# EAGLE design ESP_LoRa_Thermal_V1.62 (EAGLE 9.6.2)
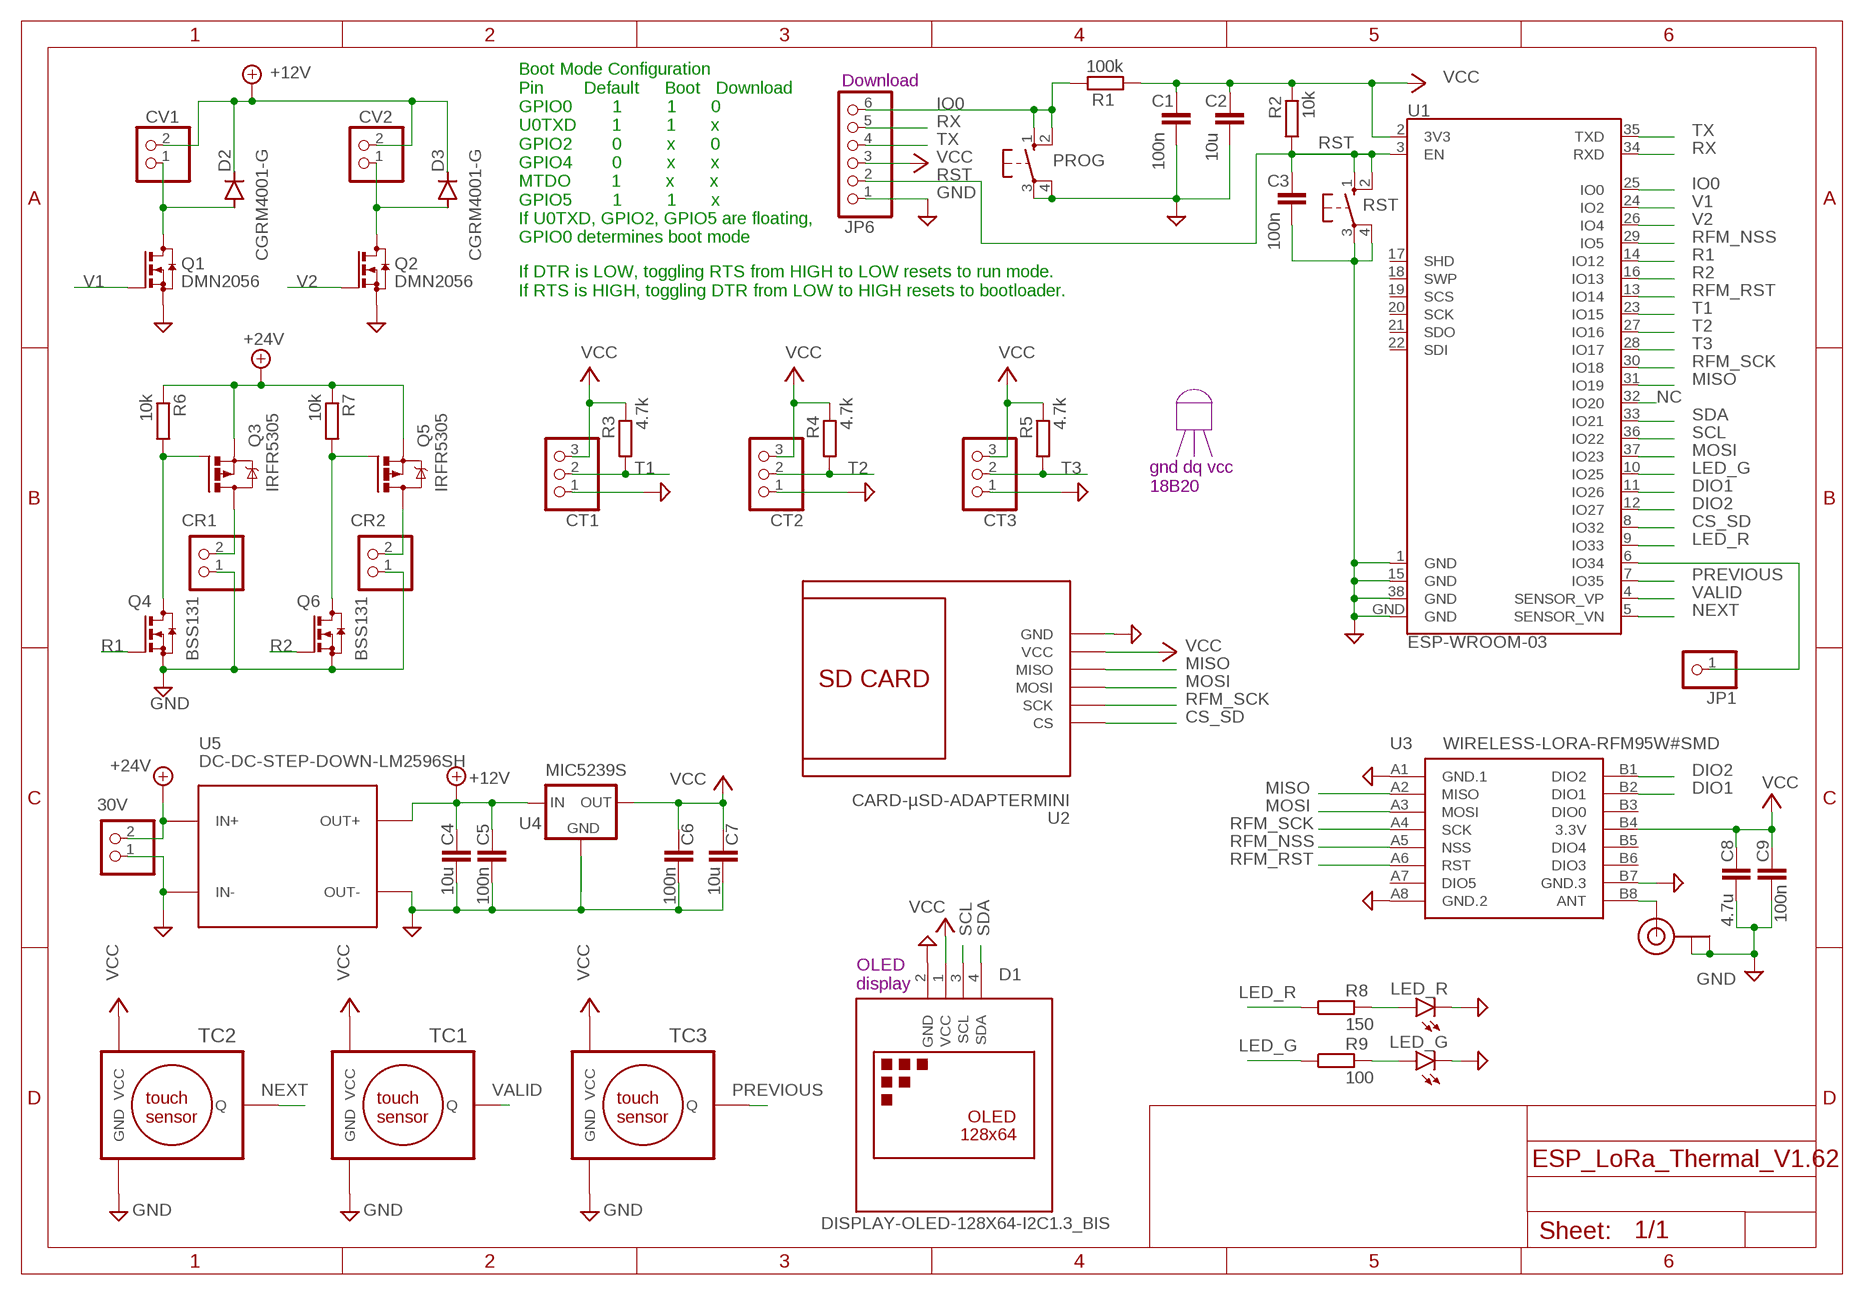
[diagram p0: schematic, sheet 1]

## Parts
30V  PINHD-1X2  [1X02]
C1  100n  CC1206  [C1206]
C2  10u  CC1206  [C1206]
C3  100n  CC1206  [C1206]
C4  10u  CC1206  [C1206]
C5  100n  CC1206  [C1206]
C6  100n  CC1206  [C1206]
C7  10u  CC1206  [C1206]
C8  4.7u  CC1206  [C1206]
C9  100n  CC1206  [C1206]
CR1  PINHD-1X2  [1X02]
CR2  PINHD-1X2  [1X02]
CT1  PINHD-1X3  [1X03]
CT2  PINHD-1X3  [1X03]
CT3  PINHD-1X3  [1X03]
CV1  PINHD-1X2  [1X02]
CV2  PINHD-1X2  [1X02]
D1  DISPLAY-OLED-128X64-I2C1.3_BIS  [DISPLAY-OLED-128X64-1.3-I2C_BIS]
D2  CGRM4001-G  [SOD-123_MINI-SMA]
D3  CGRM4001-G  [SOD-123_MINI-SMA]
J1  U.FL  [U.FL]
JP1  PINHD-1X1  [1X01]
JP6  PINHD-1X6  [1X06]
LED_G  LEDSMT1206  [1206]
LED_R  LEDSMT1206  [1206]
PROG  10-XX  [B3F-10XX]
Q1  DMN2056  [SOT23]
Q2  DMN2056  [SOT23]
Q3  IRFR5305  [D-PAK_TO252AA]
Q4  BSS131  [SOT23]
Q5  IRFR5305  [D-PAK_TO252AA]
Q6  BSS131  [SOT23]
R1  100k  RR1206  [R1206]
R2  10k  RR1206  [R1206]
R3  4.7k  RR1206  [R1206]
R4  4.7k  RR1206  [R1206]
R5  4.7k  RR1206  [R1206]
R6  10k  R-EU_R1206  [R1206]
R7  10k  R-EU_R1206  [R1206]
R8  150  RR1206  [R1206]
R9  100  RR1206  [R1206]
RST  10-XX  [B3F-10XX]
TC1  TTP223R_H  [TTP233RED_H]
TC2  TTP223R_H  [TTP233RED_H]
TC3  TTP223R_H  [TTP233RED_H]
U1  ESP-WROOM-03  [ESP-WROOM-03]
U2  CARD-µSD-ADAPTERMINI  [CARD-MINI--µSD-READER]
U3  WIRELESS-LORA-RFM95W#SMD  [WIRELESS-LORA-RFM95W#SMD]
U4  MIC5239S  [SOT223]
U5  DC-DC-STEP-DOWN-LM2596SH  [DC-DC-STEP-DOWN-LM2596-SH]

## Nets
+12V: C4.1 C5.1 CV1.2 CV2.2 D2.C D3.C U4.1(IN) U5.OUT+
+24V: 30V.2 Q3.3(S) Q5.3(S) R6.1 R7.1 U5.IN+
ANT: J1.3(SIGNAL) U3.B8(ANT)
CS_SD: U1.8(IO32) U2.CS
DIO1: U1.11(IO26) U3.B2(DIO1)
DIO2: U1.12(IO27) U3.B1(DIO2)
GND: 30V.1 C1.2 C2.2 C3.2 C4.2 C5.2 C6.2 C7.2 C8.2 C9.2 CR1.1 CR2.1 CT1.1 CT2.1 CT3.1 D1.2(GND) J1.1(GND) J1.2(GND) JP6.1 LED_G.C LED_R.C PROG.3(P) PROG.4(P1) Q1.2(S) Q2.2(S) Q4.2(S) Q6.2(S) RST.3(P) RST.4(P1) TC1.P$3(GND) TC2.P$3(GND) TC3.P$3(GND) U1.1(GND) U1.15(GND) U1.38(GND) U1.GND U2.GND U3.A1(GND.1) U3.A8(GND.2) U3.B7(GND.3) U4.2(GND) U4.4(GND) U5.IN- U5.OUT-
IO0: JP6.6 PROG.1(S) PROG.2(S1) R1.2 U1.25(IO0)
LED_G: R9.1 U1.10(IO25)
LED_R: R8.1 U1.9(IO33)
MISO: U1.31(IO19) U2.MISO U3.A2(MISO)
MOSI: U1.37(IO23) U2.MOSI U3.A3(MOSI)
N$1: CR2.2 Q5.4(D)
N$2: CV1.1 D2.A Q1.3(D)
N$4: CR1.2 Q3.4(D)
N$5: CV2.1 D3.A Q2.3(D)
N$6: JP1.1 U1.6(IO34)
N$7: LED_R.A R8.2
N$8: LED_G.A R9.2
N$23: Q3.1(G) Q4.3(D) R6.2
N$24: Q5.1(G) Q6.3(D) R7.2
NC: U1.32(IO20)
NEXT: TC2.P$2(Q) U1.5(SENSOR_VN)
PREVIOUS: TC3.P$2(Q) U1.7(IO35)
R1: Q4.1(G) U1.14(IO12)
R2: Q6.1(G) U1.16(IO13)
RFM_NSS: U1.29(IO5) U3.A5(NSS)
RFM_RST: U1.13(IO14) U3.A6(RST)
RFM_SCK: U1.30(IO18) U2.SCK U3.A4(SCK)
RST: C3.1 JP6.2 R2.1 RST.1(S) RST.2(S1) U1.3(EN)
RX: JP6.5 U1.34(RXD)
SCL: D1.3(SCL) U1.36(IO22)
SDA: D1.4(SDA) U1.33(IO21)
T1: CT1.2 R3.1 U1.23(IO15)
T2: CT2.2 R4.1 U1.27(IO16)
T3: CT3.2 R5.1 U1.28(IO17)
TX: JP6.4 U1.35(TXD)
V1: Q1.1(G) U1.24(IO2)
V2: Q2.1(G) U1.26(IO4)
VALID: TC1.P$2(Q) U1.4(SENSOR_VP)
VCC: C1.1 C2.1 C6.1 C7.1 C8.1 C9.1 CT1.3 CT2.3 CT3.3 D1.1(VCC) JP6.3 R1.1 R2.2 R3.2 R4.2 R5.2 TC1.P$1(VCC) TC2.P$1(VCC) TC3.P$1(VCC) U1.2(3V3) U2.VCC U3.B4(3.3V) U4.3(OUT)
Unconnected: U1.17(SHD) U1.18(SWP) U1.19(SCS) U1.20(SCK) U1.21(SDO) U1.22(SDI) U3.A7(DIO5) U3.B3(DIO0) U3.B5(DIO4) U3.B6(DIO3)

## Notes on the sheet
- Download
- Boot Mode Configuration
  Pin        Default     Boot   Download
  GPIO0        1         1       0
  U0TXD       1         1       x
  GPIO2        0         x       0
  GPIO4        0         x       x
  MTDO        1         x       x
  GPIO5        1         1       x
  If U0TXD, GPIO2, GPIO5 are floating, 
  GPIO0 determines boot mode
- If DTR is LOW, toggling RTS from HIGH to LOW resets to run mode.
  If RTS is HIGH, toggling DTR from LOW to HIGH resets to bootloader.
- gnd dq vcc
  18B20
- OLED 
  display

## Library data of the parts
30V CR1 CR2 CV1 CV2 = pinhead:PINHD-1X2: PIN HEADER
C1-C9 = eagle-ltspice:C: CAPACITOR, European symbol; SPICEMODEL: NONE; SPICEPREFIX: C
CT1-CT3 = pinhead:PINHD-1X3: PIN HEADER
D1 = diy-modules1.8-perso:DISPLAY-OLED-128X64-I2C: 128x64 Dot Matrix OLED Module based on SSD1306 chip Variant with I2C interface More details available here: http://www.instructables.com/id/Monochrome-096-i2c-OLED-display-with-arduino-SSD13/ SSD1306 datasheet: https://cdn-shop.adafruit.com/datasheets/SSD1306.pdf Click here to find device on ebay.com <http://www.ebay.com/sch/oled+display+128x64+iic> Note: There are two variants: I2C and SPI. Search for the proper version.
D2 D3 = diode:CGRM400*-G: Molded plasitc,JEDEC SOD-123/Mini SMA Source: Comchip CGRM4001-G.pdf
J1 = microbuilder:U.FL: U.FL Antenna Connector
JP1 = pinhead:PINHD-1X1: PIN HEADER
JP6 = pinhead:PINHD-1X6: PIN HEADER
LED_G LED_R = led:LED: LED OSRAM: - CHIPLED LG R971, LG N971, LY N971, LG Q971, LY Q971, LO R971, LY R971 LH N974, LH R974 LS Q976, LO Q976, LY Q976 LO Q996 - Hyper CHIPLED LW Q18S LB Q993, LB Q99A, LB R99A - SideLED LS A670, LO A670, LY A670, LG A670, LP A670 LB A673, LV A673, LT A673, LW A673 LH A674 LY A675 LS A676, LA A676, LO A676, LY A676, LW A676 LS A679, LY A679, LG A679 - Hyper Micro SIDELED® LS Y876, LA Y876, LO Y876, LY Y876 LT Y87S - SmartLED LW L88C, LW L88S LB L89C, LB L89S, LG L890 LS L89K, LO L89K, LY L89K LS L896, LA L896, LO L896, LY L896 - TOPLED LS T670, LO T670, LY T670, LG T670, LP T670 LSG T670, LSP T670, LSY T670, LOP T670, LYG T670 LG T671, LOG T671, LSG T671 LB T673, LV T673, LT T673, LW T673 LH T674 LS T676, LA T676, LO T676, LY T676, LB T676, LH T676, LSB T676, LW T676 LB T67C, LV T67C, LT T67C, LS T67K, LO T67K, LY T67K, LW E67C LS E67B, LA E67B, LO E67B, LY E67B, LB E67C, LV E67C, LT E67C LW T67C LS T679, LY T679, LG T679 LS T770, LO T770, LY T770, LG T770, LP T770 LB T773, LV T773, LT T773, LW T773 LH T774 LS E675, LA E675, LY E675, LS T675 LS T776, LA T776, LO T776, LY T776, LB T776 LHGB T686 LT T68C, LB T68C - Hyper Mini TOPLED® LB M676 - Mini TOPLED Santana® LG M470 LS M47K, LO M47K, LY M47K Source: http://www.osram.convergy.de LUXEON: - LUMILED® LXK2-PW12-R00, LXK2-PW12-S00, LXK2-PW14-U00, LXK2-PW14-V00 LXK2-PM12-R00, LXK2-PM12-S00, LXK2-PM14-U00 LXK2-PE12-Q00, LXK2-PE12-R00, LXK2-PE12-S00, LXK2-PE14-T00, LXK2-PE14-U00 LXK2-PB12-K00, LXK2-PB12-L00, LXK2-PB12-M00, LXK2-PB14-N00, LXK2-PB14-P00, LXK2-PB14-Q00 LXK2-PR12-L00, LXK2-PR12-M00, LXK2-PR14-Q00, LXK2-PR14-R00 LXK2-PD12-Q00, LXK2-PD12-R00, LXK2-PD12-S00 LXK2-PH12-R00, LXK2-PH12-S00 LXK2-PL12-P00, LXK2-PL12-Q00, LXK2-PL12-R00 Source: www.luxeon.com KINGBRIGHT: KA-3528ASYC Source: www.kingbright.com
PROG RST = switch-omron:10-XX: OMRON SWITCH; MPN: B3F-1000; OC_FARNELL: 176432; OC_NEWARK: 36M3542
Q1 Q2 = transistor-small-signal-perso:DMN2056: N-CHANNEL MOS FET 4 A 20 V
Q3 Q5 = transistor-power:IRF?5305: HEXFET Power MOSFET Source: http://www.irf.com/product-info/datasheets/data/irfr5305pbf.pdf
Q4 Q6 = transistor-small-signal-perso:BSS131: N-CHANNEL MOS FET
R1-R5 R8 R9 = eagle-ltspice:R: RESISTOR, European symbol; SPICEMODEL: NONE; SPICEPREFIX: R
R6 R7 = rcl:R-EU_: RESISTOR, European symbol; SPICEPREFIX: R
TC1-TC3 = esp32-lora:TTP223: Touch Key Switch
U1 = esp32-sparkfun (1):ESP-WROOM-03; OC_FARNELL: unknown
U2 = diy-modules1.8-perso:CARD-µSD-ADAPTER: Full Size SD Card Adapter Module with onboard 3.3V regulator
U3 = diy-modules:WIRELESS-LORA-RFM95W: 868/915 MHz LoRa Radio Transceiver Module based on SX1276 chip Click here to find device on ebay.com <http://www.ebay.com/sch/RFM95W+transceiver>
U4 = micrel:MIC5239S: LDO REGULATOR
U5 = diy-modules1.8-perso:DC-DC-STEP-DOWN-LM2596: DC/DC Step-Down Regulator based on LM2596-ADJ chip LM2596 datasheet available here: http://www.ti.com/lit/ds/symlink/lm2596.pdf Click here to find device on ebay.com <http://www.ebay.com/sch/lm2596+power+regulator>

## Board
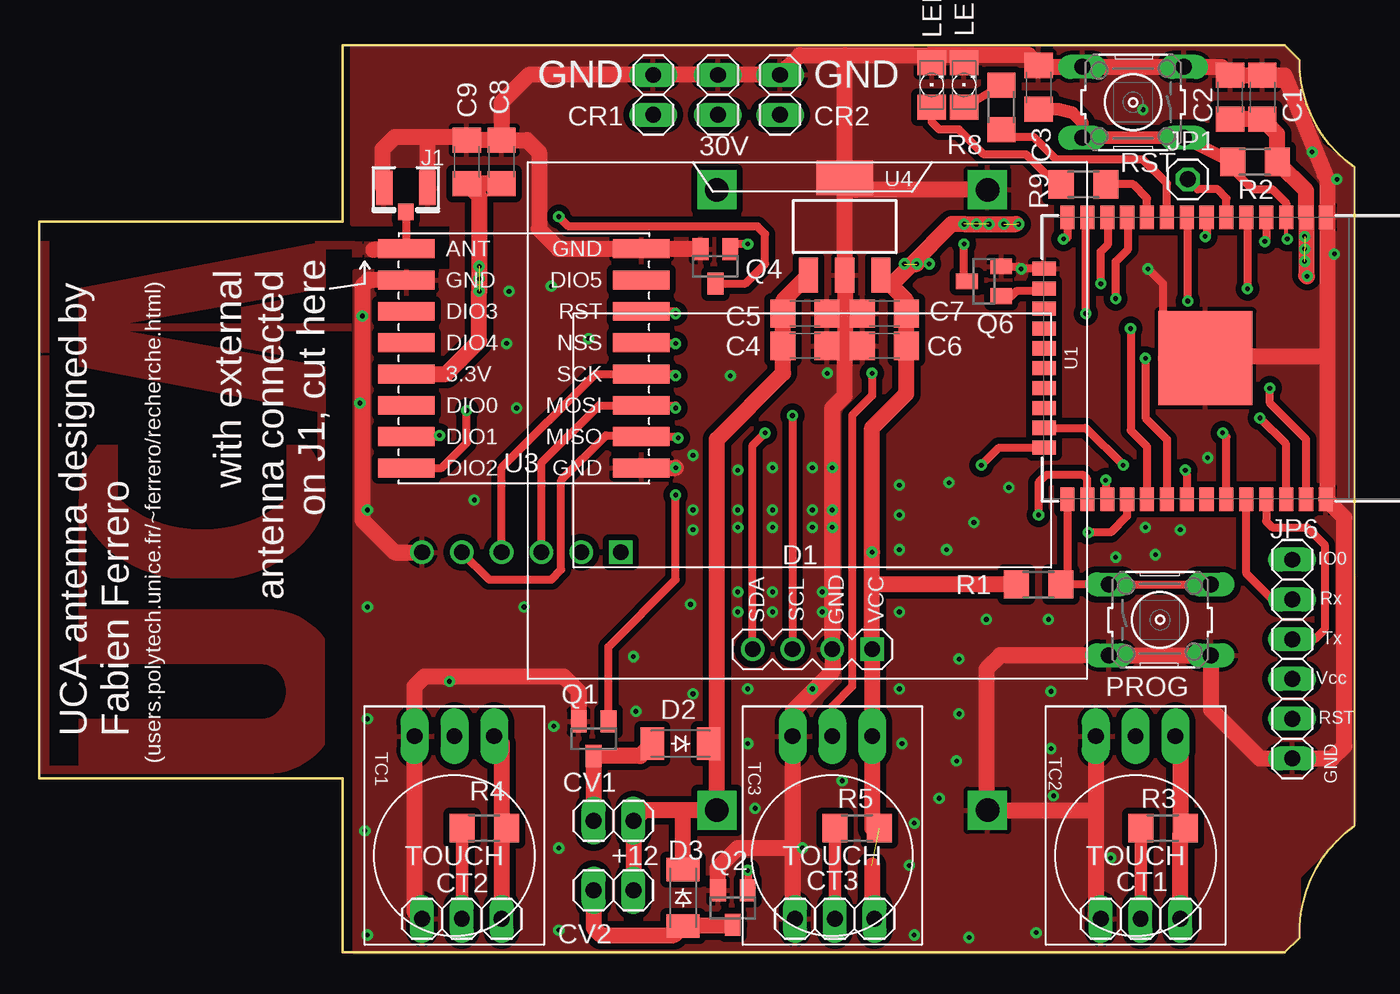
[diagram p1: board, top side]
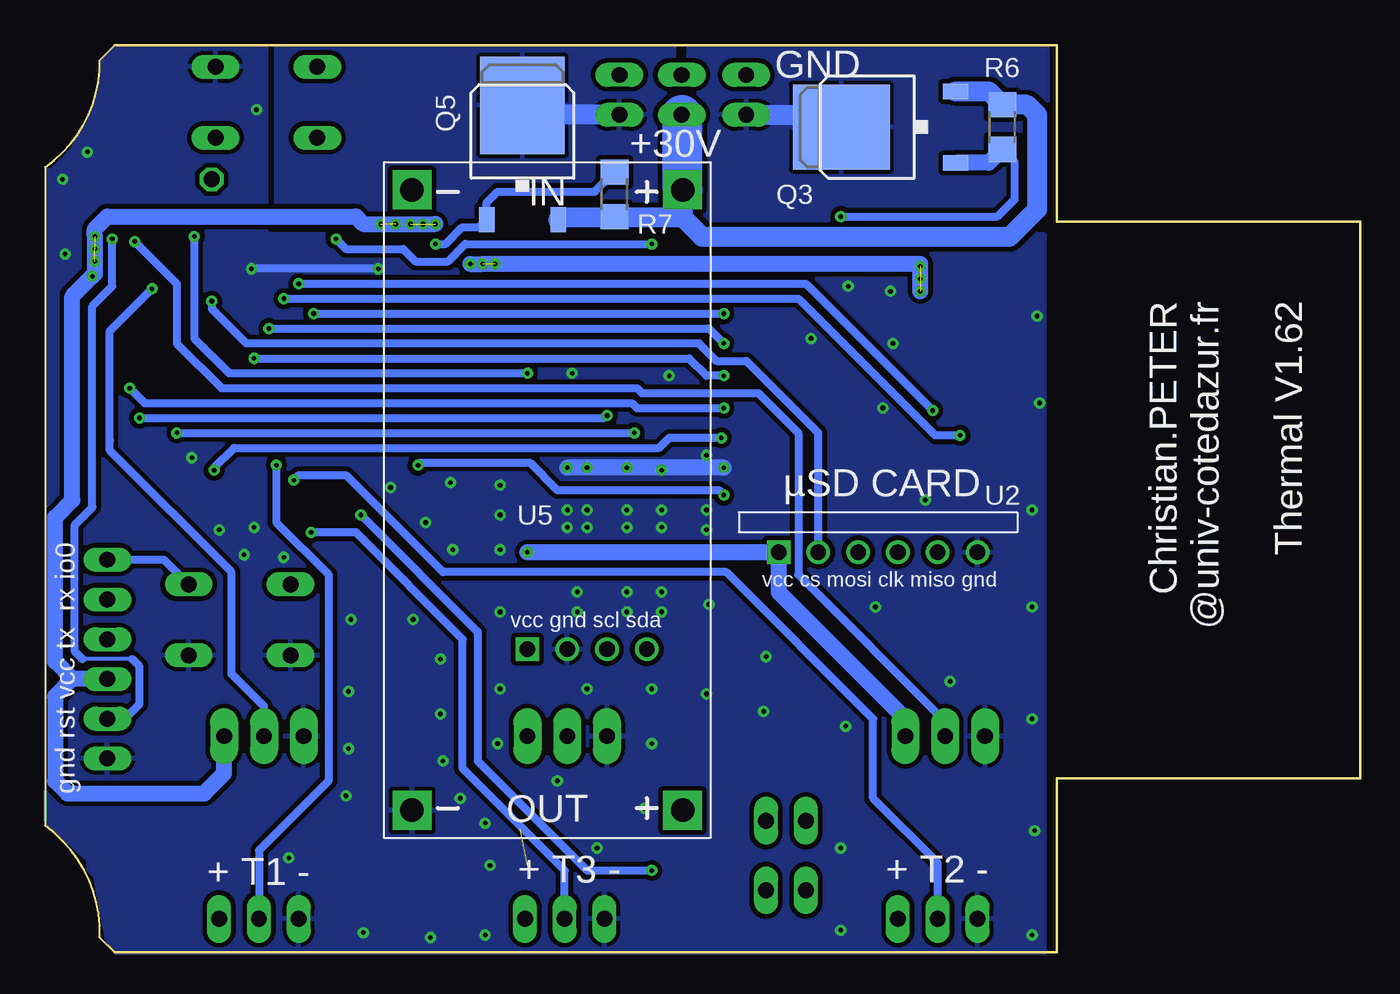
[diagram p2: board, bottom side, seen from below]

Size 83.98 x 57.94 mm. Coordinates in mm from the lower left corner, seen from the top.
Outline: 19.37,0 19.37,11.11 0,11.11 0,46.67 19.37,46.67 19.37,57.94 79.53,57.94 80.49,56.99 arc56 83.98,50.16 83.98,8.1 arc56 80.49,0.95 79.53,0 19.37,0
Copper layers (1*16): Top 0.035mm / dielectric 1.5mm / Bottom 0.035mm
Design rules "default *": minimum track width 6mil, minimum drill 0.2mm, track to track 6mil, track to pad 6mil, pad to pad 6mil, via to via 6mil, smd to smd 6mil, copper to edge 0mil, drill to drill 6mil, minimum pad ring 10mil, minimum via ring 8mil, stop-mask expansion 4mil, vias tented up to drill 0mil, thermal gap 10mil

### Footprints (pad centres in the part's own frame; a part is rotated, then mirrored left to right if it is on the bottom)
1X02 = drill 1.016 long: 1 -1.27,0; 2 1.27,0
C1206 = smd 1.6 x 1.8: 1 -1.4,0; 2 1.4,0
1X03 = drill 1.016 long: 1 -2.54,0; 2 0,0; 3 2.54,0
DISPLAY-OLED-128X64-1.3-I2C_BIS = drill 1 square: 1 -3.81,14.605 | drill 1: 2 -1.27,14.605; 3 1.27,14.605; 4 3.81,14.605
SOD-123_MINI-SMA = smd 1.5 x 2.1: A 1.8,0; C -1.8,0
U.FL = smd 2.2 x 1.05: 1 0,1.375; 2 0,-1.375 | smd 1.05 x 1: 3 1.525,0
1X01 = drill 1.016 octagon: 1 0,0
1X06 = drill 1.016 long: 1 -6.35,0; 2 -3.81,0; 3 -1.27,0; 4 1.27,0; 5 3.81,0; 6 6.35,0
1206 = smd 1.6 x 1.803: A -1.422,0; C 1.422,0
B3F-10XX = drill 1.016 long: 1 -3.251,2.261; 2 3.251,2.261; 3 -3.251,-2.261; 4 3.251,-2.261
SOT23 = smd 1 x 1.4: 1 -0.95,-1.1; 2 0.95,-1.1; 3 0,1.1
D-PAK_TO252AA = smd 1 x 1.6: 1 -2.28,-4.8; 3 2.28,-4.8 | smd 5.4 x 6.2: 4 0,2.5
R1206 = smd 1.6 x 1.803: 1 -1.422,0; 2 1.422,0
TTP233RED_H = drill 1 pad 1.778 long: P$1 1.905,2.54; P$2 1.905,0; P$3 1.905,-2.54
ESP-WROOM-03 = smd 0.9 x 1.5: 1 7.7,9; 2 6.43,9; 3 5.16,9; 4 3.89,9; 5 2.62,9; 6 1.35,9; 7 0.08,9; 8 -1.19,9; 9 -2.46,9; 10 -3.73,9; 11 -5,9; 12 -6.27,9; 13 -7.54,9; 14 -8.81,9; 25 -8.81,-9; 26 -7.54,-9; 27 -6.27,-9; 28 -5,-9; 29 -3.73,-9; 30 -2.46,-9; 31 -1.19,-9; 32 0.08,-9; 33 1.35,-9; 34 2.62,-9; 35 3.89,-9; 36 5.16,-9; 37 6.43,-9; 38 7.7,-9 | smd 1.5 x 0.9: 15 -10.3,5.715; 16 -10.3,4.445; 17 -10.3,3.175; 18 -10.3,1.905; 19 -10.3,0.635; 20 -10.3,-0.635; 21 -10.3,-1.905; 22 -10.3,-3.175; 23 -10.3,-4.445; 24 -10.3,-5.715 | smd 6 x 6: GND 0,0
CARD-MINI--µSD-READER = drill 1: CS 1.27,12.7; GND 1.27,2.54; MISO 1.27,5.08; MOSI 1.27,10.16; SCK 1.27,7.62 | drill 1 square: VCC 1.27,15.24
WIRELESS-LORA-RFM95W#SMD = smd 3.6 x 1.2: A1 -7.5,7; A2 -7.5,5; A3 -7.5,3; A4 -7.5,1; A5 -7.5,-1; A6 -7.5,-3; A7 -7.5,-5; A8 -7.5,-7; B1 7.5,7; B2 7.5,5; B3 7.5,3; B4 7.5,1; B5 7.5,-1; B6 7.5,-3; B7 7.5,-5; B8 7.5,-7
SOT223 = smd 1.219 x 2.235: 1 -2.311,-3.099; 2 0,-3.099; 3 2.311,-3.099 | smd 3.6 x 2.2: 4 0,3.099
DC-DC-STEP-DOWN-LM2596-SH = drill 1.5 pad 2.5 square: IN+ -19.812,8.636; IN- -19.812,-8.636; OUT+ 19.812,8.636; OUT- 19.812,-8.636

### Placement (x,y rotation side)
30V  43.34,54.77 270 top
C1  78.11,54.61 90 top
C2  76.04,54.61 90 top
C3  63.82,55.24 90 top
C4  48.9,38.73 0 top
C5  48.9,40.8 0 top
C6  53.98,38.73 180 top
C7  53.98,40.8 180 top
C8  29.53,50.48 90 top
C9  27.3,50.48 90 top
CR1  39.21,54.77 270 top
CR2  47.31,54.77 270 top
CT1  70.33,2.14 0 top
CT2  26.99,2.14 0 top
CT3  50.8,2.14 0 top
CV1  36.67,8.41 0 top
CV2  36.67,3.97 0 top
D1  49.37,33.97 180 top
D2  40.96,13.34 180 top
D3  41.12,3.49 270 top
J1  23.41,48.82 270 top
JP1  73.34,49.37 0 top
JP6  80.01,18.73 90 top
LED_G  56.99,55.4 90 top
LED_R  59.05,55.4 90 top
PROG  71.56,21.24 0 top
Q1  35.4,13.65 180 top
Q2  44.29,2.86 180 top
Q3  30.64,52.7 90 bottom
Q4  43.18,43.81 180 top
Q5  53.5,51.59 0 bottom
Q6  60.33,42.86 90 top
R1  63.82,23.5 0 top
R2  77.63,50.48 0 top
R3  71.75,7.94 0 top
R4  28.42,7.94 0 top
R5  52.23,7.94 0 top
R6  22.86,52.7 270 bottom
R7  47.62,48.42 90 bottom
R8  61.44,53.98 90 top
R9  66.67,49.05 180 top
RST  69.85,54.29 180 top
TC1  26.51,15.72 270 top
TC2  70.01,15.72 270 top
TC3  50.64,15.72 270 top
U1  74.46,37.95 0 top
U2  21.91,24.29 90 bottom
U3  30.96,37.94 180 top
U4  51.44,46.35 0 top
U5  51.91,28.89 270 bottom

### Tracks (layer width: path | path; a pad name or v marks a point on that pad's centre or on a via)
+12V
  Top 1.016: 43.27,13.49 U5.OUT+ 41.12,9.08 | 43.27,13.49 43.27,32.77 47.49,36.99 C4.1 C5.1 47.49,41.63 U4.1 | 41.12,9.08 38.61,9.08 CV1.2 CV2.2 | D3.C 41.12,9.08 | D2.C 42.92,13.49 43.27,13.49
+24V
  Bottom 1.27: 47.46,46.83 R7.1 47.67,46.95 | Q5.3 51.06,46.95 47.67,46.95 | 47.67,46.95 43.27,46.95 | Q3.3 23.72,54.98 R6.1 21.27,54.13 20.64,53.5 20.64,47.47 22.42,45.68 42.01,45.68 43.27,46.95 | U5.IN+ 43.27,46.95
  Bottom 2.54: U5.IN+ 43.27,53.44 30V.2
ANT
  Top 0.508: J1.3 23.46,47.25 U3.B8 23.39,44.88
  Top 1.016: 23.39,44.88 21.35,44.88
  pour Top: 14.99,11.42 0.14,11.42 0.14,38.12 0.64,38.12 0.64,11.92 2.54,11.92 2.54,14.92 14.19,14.92 14.32,14.92 14.46,14.94 14.59,14.97 14.73,15.02 14.85,15.08 14.97,15.15 15.09,15.23 15.2,15.33 15.3,15.43 15.39,15.54 15.48,15.66 15.55,15.79 15.61,15.93 15.67,16.07 15.71,16.21 15.74,16.36 15.76,16.51 15.76,16.67 15.76,16.82 15.74,16.97 15.71,17.12 15.67,17.26 15.61,17.41 15.55,17.54 15.48,17.67 15.39,17.79 15.3,17.9 15.2,18 15.09,18.1 14.97,18.18 14.85,18.25 14.73,18.31 14.59,18.36 14.46,18.39 14.32,18.41 14.19,18.42 2.54,18.42 2.54,28.92 2.57,28.92 2.55,29.53 2.61,30.14 2.75,30.73 2.99,31.34 3.31,31.9 3.72,32.41 5.03,32.41 5.03,28.92 5.17,28.92 5.5,28.62 5.85,28.36 6.22,28.12 6.63,27.89 7.06,27.69 7.5,27.51 7.96,27.36 8.44,27.24 8.92,27.14 9.42,27.07 9.92,27.02 10.42,27.01 10.92,27.02 11.42,27.07 11.92,27.14 12.41,27.24 12.88,27.36 13.35,27.51 13.78,27.69 14.21,27.89 14.62,28.12 14.99,28.36 15.34,28.62 15.67,28.92 15.82,28.92 15.82,32.41 17.13,32.41 17.25,32.26 17.37,32.11 17.49,31.94 17.59,31.78 17.69,31.62 17.79,31.45 17.79,34.51 2.54,37.42 2.54,42.41 17.64,45.29 17.64,45.42 20.14,45.42 20.14,45.41 20.64,45.41 20.64,45.24 20.76,45.24 20.76,45.41 22.54,45.41 22.54,44.39 20.77,44.39 20.77,44.56 20.64,44.56 20.64,44.4 19.99,44.4 19.99,44.92 18.31,44.92 18.31,42.41 5.61,40.17 12.91,40.17 12.91,41.22 15.4,41.66 15.4,40.17 19.99,40.17 19.99,40.42 20.39,40.42 20.39,39.41 19.99,39.41 19.99,39.67 15.4,39.67 15.4,38.16 14.21,38.38 13.08,38.55 13.08,38.59 12.91,38.61 12.91,39.67 5.61,39.67 18.31,37.42 18.31,34.42 18.24,34.43 18.24,30.17 18.3,29.63 18.29,29.08 18.21,28.54 18.06,27.99 17.83,27.47 17.55,26.98 17.18,26.48 16.76,26.03 16.3,25.61 15.76,25.21 15.17,24.87 14.57,24.57 13.89,24.29 13.2,24.08 12.49,23.92 8.35,23.92 7.75,24.05 7.15,24.23 6.57,24.44 6.03,24.68 5.51,24.95 5.02,25.27 4.58,25.59 4.16,25.94 3.79,26.34 3.47,26.73 3.19,27.15 2.95,27.59 2.95,21.92 14.99,21.92 14.99,21.9 15.4,21.85 15.81,21.75 16.21,21.62 16.59,21.44 16.96,21.23 17.31,20.99 17.65,20.71 17.96,20.4 18.24,20.06 18.24,13.27 17.96,12.93 17.65,12.62 17.31,12.34 16.96,12.1 16.59,11.89 16.21,11.71 15.81,11.58 15.4,11.48 14.99,11.43
ANT1
  pour Top: 0.64,38.31 0.14,38.31 0.14,45.42 0.64,45.42
CS_SD  (via drill 0.3)
  Top 0.508: v73.34,41.59 73.34,46.88 U1.8
  Bottom 0.508: U2.CS 34.61,33.18 39.21,37.78 41.12,37.78 42.23,38.89 71.12,38.89 73.34,41.12 v73.34,41.59
DIO1  (via drill 0.3)
  Top 0.508: U3.B2 25.48,32.94 v25.56,33.02 | v68.74,41.75 68.74,44.13 69.53,44.93 69.53,46.88 U1.11
  Bottom 0.508: v25.56,33.02 27.15,33.02 35.88,41.75 v68.74,41.75
DIO2  (via drill 0.3)
  Top 0.508: U3.B1 25.7,30.94 27.3,32.54 v27.3,34.61 | v67.79,42.7 67.79,44.77 68.26,45.24 68.26,46.88 U1.12
  Bottom 0.508: v27.3,34.61 35.4,42.7 v67.79,42.7
GND  (via drill 0.3)
  Top 0.508: Q6.2 62.55,43.81 v62.71,43.66 U1.15 | v70.8,43.66 71.75,42.7 71.75,39.69
  Top 0.813: 82.23,47.47 U1.1
  Top 1.016: 79.5,56.01 C1.2 C2.2 75.5,56.55 RST.3 RST.4 63.91,56.55 C3.2 63.18,57.28 63.18,57.31 59.05,57.31 | 79.5,56.01 79.22,55.72 | 79.5,56.01 82.07,49.69 82.23,49.37 82.23,47.47 82.23,38.1 | 59.05,57.31 56.83,57.31 | 56.83,57.31 56.83,56.98 LED_G.C | LED_R.C 59.05,57.31 | 51.44,57.31 48.58,57.31 CR2.1 30V.1 CR1.1 31.27,56.04 29.53,54.29 C8.2 | 51.44,57.31 56.83,57.31 | C8.2 C9.2 27.12,52.07 24.77,52.07 | J1.2 21.91,48.95 21.91,51.28 22.7,52.07 24.77,52.07 | J1.1 24.79,52.05 24.77,52.07 | U4.4 51.44,57.31 | U4.4 U4.2 51.44,38.73 | C7.2 C5.2 | C6.2 51.44,38.73 | 51.44,38.73 C4.2 | 82.23,38.1 82.23,29.02 U1.38 83.34,27.77 83.34,13.18 82.55,12.38 JP6.1 77.95,12.38 74.82,15.51 PROG.4 PROG.3 61.37,18.98 60.48,18.1 60.48,9.14 U5.OUT- 67.44,9.08 67.47,9.05 | 51.44,38.73 51.44,35.56 50.64,34.77 v50.64,30.96 D1.2 50.64,17.94 48.1,15.4 TC3.P$3 48.1,6.67 | U5.IN- 52.18,48.7 U4.4 | U3.B7 21.03,42.94 20.64,42.55 20.64,27.62 22.7,25.56 U2.GND | U1.GND 74.61,38.1 82.23,38.1 | C8.2 31.14,51.88 31.91,51.12 31.91,46.2 33.16,44.94 U3.A8 | U3.A8 37.13,44.94 | U3.A1 40.62,30.94 v40.64,30.96 | TC2.P$3 67.47,9.05 | 67.47,9.05 67.47,2.46 CT1.1 | 48.1,6.67 48.1,2.3 CT3.1 | CT2.1 23.97,2.62 TC1.P$3 23.97,16.99 24.61,17.62 33.5,17.62 34.45,16.67 Q1.2 | Q2.2 43.34,5.4 44.61,6.67 48.1,6.67 | Q4.2 38.48,44.91 U3.A8
  Bottom 0.508: v62.71,43.66 v70.8,43.66
  Bottom 1.016: v40.64,30.96 v50.64,30.96
  other vias: 49.37,30.96 49.37,28.26 50.64,28.26 50.64,27.15 49.37,27.15 54.93,29.84 54.93,27.94 54.93,25.72 57.94,25.72 61.91,29.69 59.69,27.46 58.1,30 74.61,31.59 72.87,26.99 70.64,27.15 68.74,25.24 71.28,25.4 64.45,21.27 60.48,21.27 58.74,18.73 58.74,15.24 58.58,12.22 57.47,9.84 55.88,8.26 64.61,16.67 64.61,13.02 64.77,10 68.42,6.03 63.66,1.27 59.37,0.95 55.88,1.11 55.56,5.56 51.28,10.95 48.74,6.67 45.72,9.21 55.09,13.34 54.93,21.75 54.93,16.83 49.37,16.83 45.24,16.83 41.75,16.51 41.59,22.23 37.94,18.89 38.1,15.4 45.24,13.34 33.18,1.43 33.18,6.67 32.86,14.45 20.95,1.11 20.8,7.78 20.95,14.92 20.95,22.07 20.95,28.26 30.96,22.07 26.19,17.3 27.78,28.89 20.64,40.64 20.48,35.08 30,42.23 32.7,42.55 29.84,38.89 30.48,34.77 35.08,39.21 82.71,44.61 82.87,49.37 81.28,51.12 70.48,53.82 44.13,36.83 50.32,36.99 46.83,28.26 46.83,27.15 44.61,27.15 44.61,28.26 44.61,30.8 46.83,30.96 44.61,23.02 44.61,21.75 46.83,23.02 46.83,21.75 50.01,21.75 50.01,23.02 41.75,28.26 41.75,26.99 41.75,31.75
  pour Top (isolate 0.406): 20.16,0 20.16,43.5 26.35,43.5 26.35,46.51 20,46.51 20,57.78 79.53,57.78 80.33,56.99 80.33,55.56 81.81,51.62 83.82,50.12 83.93,8.33 81.9,6.43 81.9,6.33 80.41,4.85 80.41,1.04 79.38,0
  pour Bottom (isolate 0.305): 20.16,0 20.16,45.84 69.85,45.88 69.85,57.78 79.38,57.78 80.38,56.95 80.64,54.29 82.23,51.28 83.66,49.84 83.71,49.94 83.82,49.94 83.93,8.45 81.21,5.89 81.21,5.32 80.79,4.91 79.98,0.61 79.38,0
IO0
  Top 0.508: U1.25 65.65,23.91 R1.2 PROG.1 PROG.2
  Bottom 0.508: JP6.6 76.4,25.08 PROG.2
LED_G
  Top 0.508: U1.10 70.73,48.17 69.85,49.05 R9.1
LED_R
  Top 0.508: U1.9 72,49.12 70.48,50.64 64.94,50.64 63.5,52.08 61.91,52.08 R8.1
MISO  (via drill 0.3)
  Top 0.508: U2.MISO 28.73,23.81 32.7,23.81 33.34,24.45 33.34,30.16 36.2,33.02 38.38,33.02 U3.A2 40.72,32.94 v40.8,32.86 | v73.18,30.8 73.18,30.66 73.27,30.57 U1.31
  Bottom 0.508: v40.8,32.86 44.13,32.86 44.77,32.23 71.91,32.23 73.18,30.96 v73.18,30.8
MOSI  (via drill 0.3)
  Top 0.508: U2.MOSI 32.07,31.27 35.73,34.94 U3.A3 40.64,34.94 v40.64,34.77 | U1.37 80.89,32.76 78.58,35.07 v78.58,36.04
  Bottom 0.508: v78.58,36.04 77.63,35.08 46.51,35.08 46.2,34.77 v40.64,34.77
N$1
  Bottom 1.27: CR2.2 53.66,53.5 53.82,53.34 53.66,53.18 53.5,53.34 Q5.4
  pour Bottom (isolate 0.305): 43.81,57.78 69.22,57.78 69.22,46.35 43.81,46.35
N$2
  Top 1.016: CV1.1 Q1.3 38.38,12.55 D2.A
N$4
  Bottom 1.27: CR1.2 33.18,53.5 33.02,53.66 33.02,52.82 Q3.4
  pour Bottom (isolate 0.305): 20,46.51 42.86,46.51 42.86,57.78 20,57.78
N$5
  Top 1.016: CV2.1 35.4,1.59 35.88,1.11 40.53,1.11 D3.A 44.23,1.69 Q2.3
N$6
  Top 0.508: U1.6 75.81,48.17 75.25,48.74 73.98,48.74 JP1.1
N$7
  Top 0.508: LED_R.A R8.2
N$8
  Top 0.508: R9.2 64.93,49.05 63.02,50.96 60.33,50.96 58.74,52.55 57.47,52.55 56.99,53.02 LED_G.A
N$23  (via drill 0.3)
  Top 0.508: Q4.3 45.1,42.72 46.35,43.97 46.35,45.88 45.88,46.35 33.81,46.35 v33.18,46.99
  Bottom 0.508: R6.2 22.07,50.49 22.07,48.1 23.18,46.99 v33.18,46.99
  Bottom 1.016: R6.2 23.72,50.42 Q3.1
N$24  (via drill 0.3)
  Top 0.508: Q6.3 59.05,43.03 v59.05,45.24
  Bottom 0.508: v59.05,45.24 58.42,45.24 57.35,46.32 56.26,46.32 Q5.1 55.78,47.88 55.09,48.58 48.89,48.58 R7.2
NEXT  (via drill 0.3)
  Top 0.508: U1.5 77.15,46.88 v77.15,42.39
  Bottom 0.508: TC2.P$2 70.01,15.72 71.75,17.46 72.07,17.78 72.07,24.29 79.85,32.07 79.85,32.7 79.85,39.69 v77.15,42.39
PREVIOUS  (via drill 0.3)
  Top 0.508: U1.7 74.54,45.81 v74.45,45.72 | v53.18,36.99 53.18,35.56 51.91,34.29 51.91,16.99 50.64,15.72 TC3.P$2
  Bottom 0.508: 74.45,45.56 v74.45,45.72 74.45,39.21 72.23,36.99 v53.18,36.99
R1  (via drill 0.3)
  Top 0.508: U1.14 65.65,45.65 65.56,45.56 v65.41,45.56 | v45.24,45.24 44.46,45.24 Q4.1
  Bottom 0.508: v65.41,45.56 64.77,44.93 61.12,44.93 60.33,44.13 58.26,44.13 57.15,45.24 v45.24,45.24
R2
  Top 0.508: U1.16 64,42.23 62.39,42.23 62.07,41.91 Q6.1
RFM_NSS  (via drill 0.3)
  Top 0.508: U3.A5 38.5,38.89 v40.64,38.89 | v69.69,39.85 69.69,33.34 70.73,32.3 U1.29
  Bottom 0.508: v69.69,39.85 41.59,39.85 v40.64,38.89
RFM_RST  (via drill 0.3)
  Top 0.508: U3.A6 40.64,40.94 v40.64,40.8 | v66.83,40.8 66.83,46.86 U1.13
  Bottom 0.508: v66.83,40.8 v40.64,40.8
RFM_SCK  (via drill 0.3)
  Top 0.508: U2.SCK 29.53,30.96 35.51,36.94 U3.A4 40.53,36.94 v40.64,36.83 | U1.30 72,32.77 70.64,34.13 v70.64,37.94
  Bottom 0.508: v40.64,36.83 41.75,36.83 42.86,37.94 v70.64,37.94
RST  (via drill 0.3)
  Top 0.254: v79.69,45.56 79.62,45.63 U1.3
  Top 0.508: R2.1 76.21,50 77.47,48.74 78.74,48.74 79.62,47.85 U1.3
  Top 0.813: C3.1 65.08,53.84 65.96,53.62 66.6,52.98 RST.2 RST.1 R2.1
  Bottom 0.254: 78.42,18.73 81.6,18.73
  Bottom 0.508: JP6.2 78.9,14.92 77.95,15.88 77.95,18.26 78.42,18.73 | 81.6,18.73 82.07,19.21 82.07,27.3 80.96,28.42 80.96,41.27 79.69,42.55 v79.69,45.56
RX
  Top 0.508: JP6.5 78.74,22.54 77.08,24.2 U1.34
SCL  (via drill 0.3)
  Top 0.508: U1.36 79.62,32.45 v77.95,34.13 | v48.1,34.29 D1.3
  Bottom 0.508: v77.95,34.13 48.26,34.13 v48.1,34.29
SDA  (via drill 0.3)
  Top 0.508: U1.33 75.81,32.93 v75.56,33.18 | D1.4 45.56,32.38 v46.35,33.18
  Bottom 0.508: v75.56,33.18 v46.35,33.18
T1  (via drill 0.3)
  Top 0.508: U1.23 66.83,33.5 v69.22,31.11
  Top 0.813: R3.1 CT1.2
  Bottom 0.508: v69.22,31.11 69.22,27.46 65.88,24.13 65.88,10.95 70.33,6.51 CT1.2
T2  (via drill 0.3)
  Top 0.508: v68.1,30.16 68.1,29.04 U1.27
  Top 0.813: R4.1 CT2.2
  Bottom 0.508: CT2.2 26.99,5.71 31.11,9.84 31.11,14.92 40.48,24.29 58.58,24.29 64.77,30.48 67.79,30.48 v68.1,30.16
T3  (via drill 0.3)
  Top 0.508: U1.28 69.46,27.87 68.42,26.83 v66.99,26.83
  Top 0.813: R5.1 CT3.2
  Bottom 0.508: CT3.2 50.8,5.24 57.31,11.75 57.31,20 64.14,26.83 v66.99,26.83
TX
  Top 0.508: U1.35 78.35,27.53 78.74,27.15 80.96,27.15 82.07,26.04 82.07,20.64 81.44,20 JP6.4
V1  (via drill 0.3)
  Top 0.508: Q1.1 36.35,19.52 40.64,23.81 v40.64,29.21 | v60.17,31.11 61.28,32.23 U1.24
  Bottom 0.508: v40.64,29.21 40.96,29.53 51.28,29.53 53.02,31.27 60.01,31.27 v60.17,31.11
V2  (via drill 0.3)
  Top 0.508: U1.26 66.92,30.23 66.67,30.48 64.29,30.48 63.82,30 v63.82,27.94 | v45.24,5.24 Q2.1
  Bottom 0.508: v63.82,27.94 56.36,20.48 56.36,12.22 49.37,5.24 v45.24,5.24
VALID  (via drill 0.3)
  Top 0.508: U1.4 78.35,45.49 v78.26,45.4
  Bottom 0.508: v78.26,45.4 75.56,42.7 75.56,38.89 72.71,36.04 46.2,36.04 45.88,35.72 38.42,35.72 35.88,33.18 35.88,24.13 26.51,14.76 TC1.P$2
VCC  (via drill 0.3)  (10 unrouted)
  Top 1.016: C2.1 C1.1 79.05,52.26 R2.2 80.89,48.64 U1.2 80.89,43.25 v80.96,43.18 | U3.B4 25.99,36.94 28.1,39.05 v28.1,42.23 28.1,48.29 C9.1 C8.1 | 53.18,23.65 D1.1 TC3.P$1 53.18,7.94 R5.2 | 53.18,23.65 v53.18,25.56 53.18,33.5 55.38,35.69 C6.1 C7.1 55.38,41.63 54.38,42.63 | 54.38,42.63 U4.3 | 55.72,43.97 54.38,42.63 | 55.72,43.97 v56.04,43.97 | 55.72,43.97 58.26,46.51 v59.05,46.51 62.39,46.51 | CT1.3 72.87,7.63 | 72.87,7.63 R3.2 | TC2.P$1 72.87,13.49 72.87,7.63 | 53.18,5.56 53.18,2.3 CT3.3 | TC1.P$1 29.53,13.34 29.53,7.94 | 29.53,7.94 CT2.3 | R4.2 29.53,7.94 | R1.1 53.34,23.5 53.18,23.65
  Bottom 1.016: 82.23,17.46 83.34,18.57 83.34,27.78 82.23,28.89 82.23,41.91 v80.96,43.18 80.8,43.34 v80.8,45.72 80.8,46.2 80.01,46.99 64.14,46.99 63.66,46.51 v59.05,46.51 | v53.18,25.56 U2.VCC 37.15,23.02 29.05,14.92 TC1.P$1 | v28.1,42.23 28.1,43.97 v56.04,43.97 v56.83,43.97 | JP6.3 82.23,17.46 | 82.23,17.46 83.34,16.35 83.34,10.95 82.55,10.16 73.82,10.16 72.55,11.43 TC2.P$1
  other vias: 80.8,44.93 80.8,44.13 59.85,46.51 60.64,46.51 61.59,46.51 62.55,46.51 55.24,43.97 28.1,43.02 28.1,43.81

### Text on the board
tNames: GND | GND | GND | with external / antenna connected / on J1, cut here | IO0 | Rx | Tx | Vcc | RST | UCA antenna designed by / Fabien Ferrero | GND | (users.polytech.unice.fr/~ferrero/recherche.html) | +12
bNames: GND | +30V | Christian.PETER / @univ-cotedazur.fr / / Thermal V1.62 | gnd rst vcc tx rx io0 | vcc cs mosi clk miso gnd | vcc gnd scl sda | + T2 - | + T3 - | + T1 -
tValues: 84 x 58 mm